# Altium schematic sheet MCU.SchDoc: Test
size A4; DrawnBy: Łukasz Przeniosło; Organization: PRZENIOSLO; Address1: Electronics; Address2: &; Address3: Software; Revision: 1.0; SheetNumber: 0; SheetTotal: 0
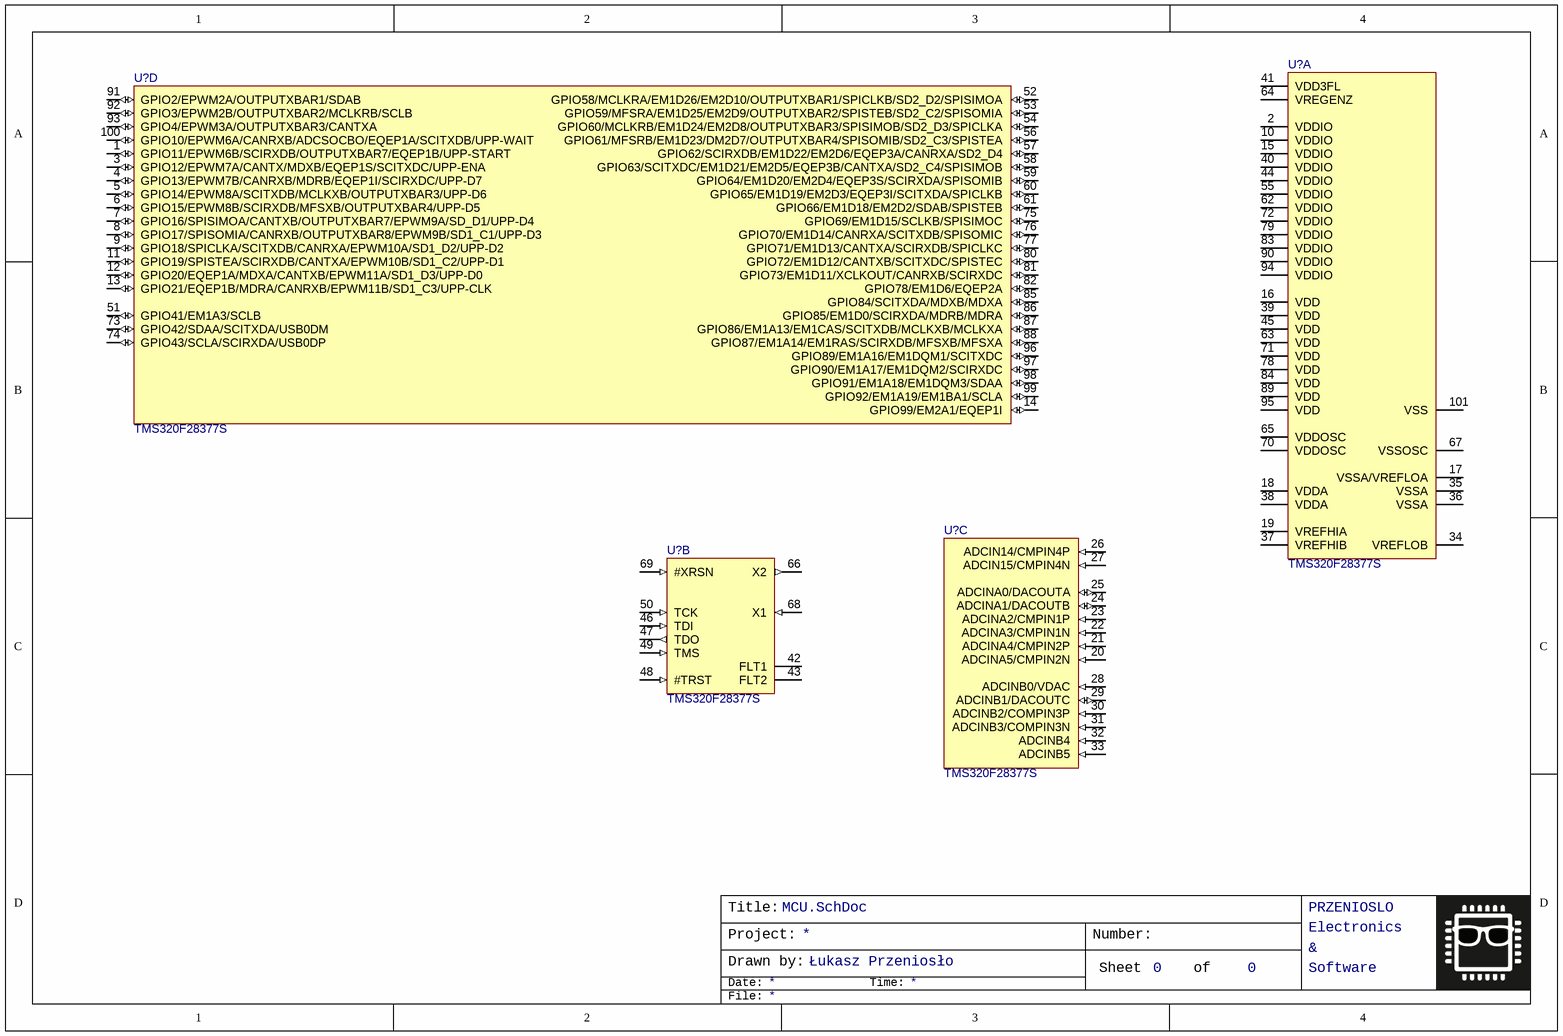
[diagram p0: MCU.SchDoc]

## Parts
(Parts that share a designator on the sheet are numbered #1, #2 ... from top to bottom, then left to right.)
U?#1  TMS320F28377S  [PQFP100_L]  (part D of 4)
U?#2  TMS320F28377S  [PQFP100_L]  (part A of 4)
U?#3  TMS320F28377S  [PQFP100_L]  (part B of 4)
U?#4  TMS320F28377S  [PQFP100_L]  (part C of 4)

## Nets

Not connected (* = marked no-connect by the designer): U?#1 1(GPIO11/EPWM6B/SCIRXDB/OUTPUTXBAR7/EQEP1B/UPP-START) 3(GPIO12/EPWM7A/CANTX/MDXB/EQEP1S/SCITXDC/UPP-ENA) 4(GPIO13/EPWM7B/CANRXB/MDRB/EQEP1I/SCIRXDC/UPP-D7) 5(GPIO14/EPWM8A/SCITXDB/MCLKXB/OUTPUTXBAR3/UPP-D6) 6(GPIO15/EPWM8B/SCIRXDB/MFSXB/OUTPUTXBAR4/UPP-D5) 7(GPIO16/SPISIMOA/CANTXB/OUTPUTXBAR7/EPWM9A/SD_D1/UPP-D4) 8(GPIO17/SPISOMIA/CANRXB/OUTPUTXBAR8/EPWM9B/SD1_C1/UPP-D3) 9(GPIO18/SPICLKA/SCITXDB/CANRXA/EPWM10A/SD1_D2/UPP-D2) 11(GPIO19/SPISTEA/SCIRXDB/CANTXA/EPWM10B/SD1_C2/UPP-D1) 12(GPIO20/EQEP1A/MDXA/CANTXB/EPWM11A/SD1_D3/UPP-D0) 13(GPIO21/EQEP1B/MDRA/CANRXB/EPWM11B/SD1_C3/UPP-CLK) 14(GPIO99/EM2A1/EQEP1I) 51(GPIO41/EM1A3/SCLB) 52(GPIO58/MCLKRA/EM1D26/EM2D10/OUTPUTXBAR1/SPICLKB/SD2_D2/SPISIMOA) 53(GPIO59/MFSRA/EM1D25/EM2D9/OUTPUTXBAR2/SPISTEB/SD2_C2/SPISOMIA) 54(GPIO60/MCLKRB/EM1D24/EM2D8/OUTPUTXBAR3/SPISIMOB/SD2_D3/SPICLKA) 56(GPIO61/MFSRB/EM1D23/DM2D7/OUTPUTXBAR4/SPISOMIB/SD2_C3/SPISTEA) 57(GPIO62/SCIRXDB/EM1D22/EM2D6/EQEP3A/CANRXA/SD2_D4) 58(GPIO63/SCITXDC/EM1D21/EM2D5/EQEP3B/CANTXA/SD2_C4/SPISIMOB) 59(GPIO64/EM1D20/EM2D4/EQEP3S/SCIRXDA/SPISOMIB) 60(GPIO65/EM1D19/EM2D3/EQEP3I/SCITXDA/SPICLKB) 61(GPIO66/EM1D18/EM2D2/SDAB/SPISTEB) 73(GPIO42/SDAA/SCITXDA/USB0DM) 74(GPIO43/SCLA/SCIRXDA/USB0DP) 75(GPIO69/EM1D15/SCLKB/SPISIMOC) 76(GPIO70/EM1D14/CANRXA/SCITXDB/SPISOMIC) 77(GPIO71/EM1D13/CANTXA/SCIRXDB/SPICLKC) 80(GPIO72/EM1D12/CANTXB/SCITXDC/SPISTEC) 81(GPIO73/EM1D11/XCLKOUT/CANRXB/SCIRXDC) 82(GPIO78/EM1D6/EQEP2A) 85(GPIO84/SCITXDA/MDXB/MDXA) 86(GPIO85/EM1D0/SCIRXDA/MDRB/MDRA) 87(GPIO86/EM1A13/EM1CAS/SCITXDB/MCLKXB/MCLKXA) 88(GPIO87/EM1A14/EM1RAS/SCIRXDB/MFSXB/MFSXA) 91(GPIO2/EPWM2A/OUTPUTXBAR1/SDAB) 92(GPIO3/EPWM2B/OUTPUTXBAR2/MCLKRB/SCLB) 93(GPIO4/EPWM3A/OUTPUTXBAR3/CANTXA) 96(GPIO89/EM1A16/EM1DQM1/SCITXDC) 97(GPIO90/EM1A17/EM1DQM2/SCIRXDC) 98(GPIO91/EM1A18/EM1DQM3/SDAA) 99(GPIO92/EM1A19/EM1BA1/SCLA) 100(GPIO10/EPWM6A/CANRXB/ADCSOCBO/EQEP1A/SCITXDB/UPP-WAIT); U?#2 2(VDDIO) 10(VDDIO) 15(VDDIO) 16(VDD) 17(VSSA/VREFLOA) 18(VDDA) 19(VREFHIA) 34(VREFLOB) 35(VSSA) 36(VSSA) 37(VREFHIB) 38(VDDA) 39(VDD) 40(VDDIO) 41(VDD3FL) 44(VDDIO) 45(VDD) 55(VDDIO) 62(VDDIO) 63(VDD) 64(VREGENZ) 65(VDDOSC) 67(VSSOSC) 70(VDDOSC) 71(VDD) 72(VDDIO) 78(VDD) 79(VDDIO) 83(VDDIO) 84(VDD) 89(VDD) 90(VDDIO) 94(VDDIO) 95(VDD) 101(VSS); U?#3 42(FLT1) 43(FLT2) 46(TDI) 47(TDO) 48(#TRST) 49(TMS) 50(TCK) 66(X2) 68(X1) 69(#XRSN); U?#4 20(ADCINA5/CMPIN2N) 21(ADCINA4/CMPIN2P) 22(ADCINA3/CMPIN1N) 23(ADCINA2/CMPIN1P) 24(ADCINA1/DACOUTB) 25(ADCINA0/DACOUTA) 26(ADCIN14/CMPIN4P) 27(ADCIN15/CMPIN4N) 28(ADCINB0/VDAC) 29(ADCINB1/DACOUTC) 30(ADCINB2/COMPIN3P) 31(ADCINB3/COMPIN3N) 32(ADCINB4) 33(ADCINB5)

## Notes on the sheet
- Title:
- Date:
- Drawn by:
- Project:
- Time:
- Number:
- Sheet
- of
- File:

## Library data of the parts
U?#1-U?#4 = TMS320F28377S: TMS320F2837xS Delfino™ Microcontrollers